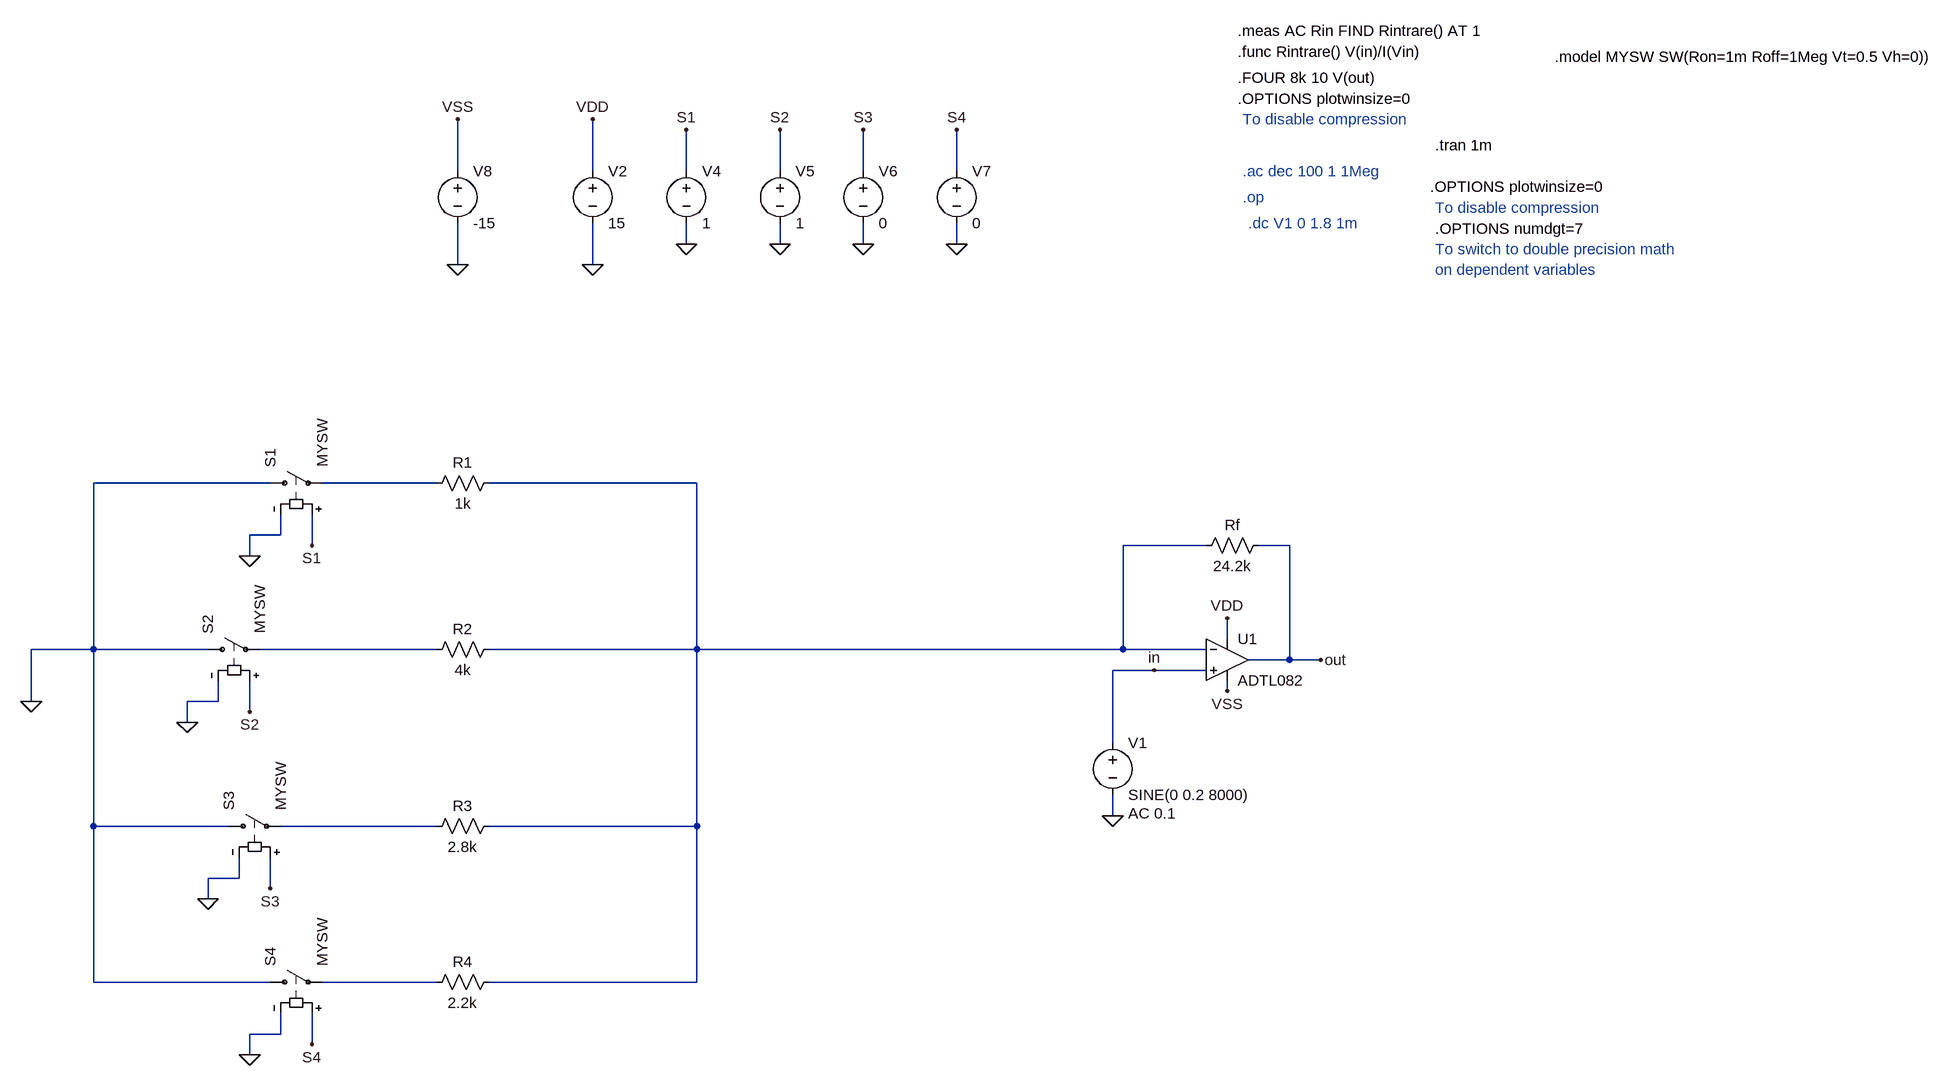
[diagram p0: schematic tb_PGA_serie_AO_ideal_switchIdeal.asc]
tb_PGA_serie_AO_ideal_switchIdeal.asc, the LTspice schematic file:
Version 4
SHEET 1 1820 2436
WIRE -1360 -240 -1360 -320
WIRE -1152 -240 -1152 -320
WIRE -1008 -240 -1008 -304
WIRE -864 -240 -864 -304
WIRE -736 -240 -736 -304
WIRE -592 -240 -592 -304
WIRE -1008 -128 -1008 -160
WIRE -864 -128 -864 -160
WIRE -736 -128 -736 -160
WIRE -592 -128 -592 -160
WIRE -1360 -96 -1360 -160
WIRE -1152 -96 -1152 -160
WIRE -1648 240 -1920 240
WIRE -1392 240 -1568 240
WIRE -992 240 -1312 240
WIRE -1632 320 -1632 288
WIRE -1632 320 -1680 320
WIRE -1584 336 -1584 288
WIRE -208 336 -336 336
WIRE -80 336 -128 336
WIRE -1680 352 -1680 320
WIRE -176 480 -176 448
WIRE -1920 496 -1920 240
WIRE -1920 496 -2016 496
WIRE -1744 496 -1920 496
WIRE -1392 496 -1664 496
WIRE -992 496 -992 240
WIRE -992 496 -1312 496
WIRE -336 496 -336 336
WIRE -336 496 -992 496
WIRE -208 496 -336 496
WIRE -80 512 -80 336
WIRE -80 512 -144 512
WIRE -32 512 -80 512
WIRE -288 528 -352 528
WIRE -208 528 -288 528
WIRE -176 560 -176 544
WIRE -2016 576 -2016 496
WIRE -1728 576 -1728 544
WIRE -1728 576 -1776 576
WIRE -1680 592 -1680 544
WIRE -1776 608 -1776 576
WIRE -352 640 -352 528
WIRE -352 752 -352 720
WIRE -1920 768 -1920 496
WIRE -1712 768 -1920 768
WIRE -1392 768 -1632 768
WIRE -992 768 -992 496
WIRE -992 768 -1312 768
WIRE -1696 848 -1696 816
WIRE -1696 848 -1744 848
WIRE -1648 864 -1648 816
WIRE -1744 880 -1744 848
WIRE -1920 1008 -1920 768
WIRE -1648 1008 -1920 1008
WIRE -1392 1008 -1568 1008
WIRE -992 1008 -992 768
WIRE -992 1008 -1312 1008
WIRE -1632 1088 -1632 1056
WIRE -1632 1088 -1680 1088
WIRE -1584 1104 -1584 1056
WIRE -1680 1120 -1680 1088
FLAG -1152 -96 0
FLAG -1152 -320 VDD
FLAG -352 752 0
FLAG -1008 -128 0
FLAG -1008 -304 S1
FLAG -864 -128 0
FLAG -864 -304 S2
FLAG -736 -128 0
FLAG -736 -304 S3
FLAG -592 -128 0
FLAG -592 -304 S4
FLAG -32 512 out
FLAG -176 448 VDD
FLAG -176 560 VSS
FLAG -2016 576 0
FLAG -288 528 in
FLAG -1360 -96 0
FLAG -1360 -320 VSS
FLAG -1584 336 S1
FLAG -1680 352 0
FLAG -1680 592 S2
FLAG -1776 608 0
FLAG -1648 864 S3
FLAG -1744 880 0
FLAG -1680 1120 0
FLAG -1584 1104 S4
DATAFLAG 16 512 ""
SYMBOL voltage -1152 -256 R0
WINDOW 123 0 0 Left 2
WINDOW 39 0 0 Left 2
SYMATTR InstName V2
SYMATTR Value 15
SYMBOL voltage -352 624 R0
WINDOW 123 24 124 Left 2
WINDOW 39 0 0 Left 2
SYMATTR Value2 AC 0.1
SYMATTR InstName V1
SYMATTR Value SINE(0 0.2 8000)
SYMBOL res -1408 256 R270
WINDOW 0 32 56 VTop 2
WINDOW 3 0 56 VBottom 2
SYMATTR InstName R1
SYMATTR Value 1k
SYMBOL voltage -1008 -256 R0
WINDOW 123 0 0 Left 2
WINDOW 39 0 0 Left 2
SYMATTR InstName V4
SYMATTR Value 1
SYMBOL voltage -864 -256 R0
WINDOW 123 0 0 Left 2
WINDOW 39 0 0 Left 2
SYMATTR InstName V5
SYMATTR Value 1
SYMBOL voltage -736 -256 R0
WINDOW 123 0 0 Left 2
WINDOW 39 0 0 Left 2
SYMATTR InstName V6
SYMATTR Value 0
SYMBOL voltage -592 -256 R0
WINDOW 123 0 0 Left 2
WINDOW 39 0 0 Left 2
SYMATTR InstName V7
SYMATTR Value 0
SYMBOL res -112 320 R90
WINDOW 0 0 56 VBottom 2
WINDOW 3 32 56 VTop 2
SYMATTR InstName Rf
SYMATTR Value 24.2k
SYMBOL res -1408 784 R270
WINDOW 0 32 56 VTop 2
WINDOW 3 0 56 VBottom 2
SYMATTR InstName R3
SYMATTR Value 2.8k
SYMBOL res -1408 512 R270
WINDOW 0 32 56 VTop 2
WINDOW 3 0 56 VBottom 2
SYMATTR InstName R2
SYMATTR Value 4k
SYMBOL sw -1664 240 R270
SYMATTR InstName S1
SYMATTR Value MYSW
SYMBOL sw -1760 496 R270
SYMATTR InstName S2
SYMATTR Value MYSW
SYMBOL sw -1728 768 R270
SYMATTR InstName S3
SYMATTR Value MYSW
SYMBOL voltage -1360 -256 R0
WINDOW 123 0 0 Left 2
WINDOW 39 0 0 Left 2
SYMATTR InstName V8
SYMATTR Value -15
SYMBOL OpAmps\\ADTL082 -176 448 R0
SYMATTR InstName U1
SYMBOL res -1408 1024 R270
WINDOW 0 32 56 VTop 2
WINDOW 3 0 56 VBottom 2
SYMATTR InstName R4
SYMATTR Value 2.2k
SYMBOL sw -1664 1008 R270
SYMATTR InstName S4
SYMATTR Value MYSW
TEXT -152 -240 Left 2 ;.ac dec 100 1 1Meg
TEXT -152 -200 Left 2 ;.op
TEXT 144 -280 Left 2 !.tran 1m
TEXT 136 -216 Left 2 !.OPTIONS plotwinsize=0
TEXT 144 -184 Left 2 ;To disable compression
TEXT 144 -152 Left 2 !.OPTIONS numdgt=7
TEXT 144 -120 Left 2 ;To switch to double precision math\non dependent variables
TEXT -160 -456 Left 2 !.meas AC Rin FIND Rintrare() AT 1
TEXT -160 -424 Left 2 !.func Rintrare() V(in)/I(Vin)
TEXT -160 -384 Left 2 !.FOUR 8k 10 V(out)
TEXT -160 -352 Left 2 !.OPTIONS plotwinsize=0
TEXT -152 -320 Left 2 ;To disable compression
TEXT -144 -160 Left 2 ;.dc V1 0 1.8 1m
TEXT 328 -416 Left 2 !.model MYSW SW(Ron=1m Roff=1Meg Vt=0.5 Vh=0))

The netlist it stands for:
* tb_PGA_serie_AO_ideal_switchIdeal.asc
V2 VDD 0 15
V1 in 0 SINE(0 0.2 8000) AC 0.1
R1 N001 N002 1k
V4 S1 0 1
V5 S2 0 1
V6 S3 0 0
V7 S4 0 0
Rf out N002 24.2k
R3 N004 N002 2.8k
R2 N003 N002 4k
S1 0 N001 S1 0 MYSW
S2 0 N003 S2 0 MYSW
S3 0 N004 S3 0 MYSW
V8 VSS 0 -15
XU1 in N002 VDD VSS out ADTL082  ; pins In+ In- V+ V- OUT
R4 N005 N002 2.2k
S4 0 N005 S4 0 MYSW
* .ac dec 100 1 1Meg
* .op
.tran 1m
.OPTIONS plotwinsize=0
* To disable compression
.OPTIONS numdgt=7
* To switch to double precision math
* on dependent variables
.meas AC Rin FIND Rintrare() AT 1
.func Rintrare() V(in)/I(Vin)
.FOUR 8k 10 V(out)
.OPTIONS plotwinsize=0
* To disable compression
* .dc V1 0 1.8 1m
.model MYSW SW(Ron=1m Roff=1Meg Vt=0.5 Vh=0))
.lib ADI.lib
.backanno
.end